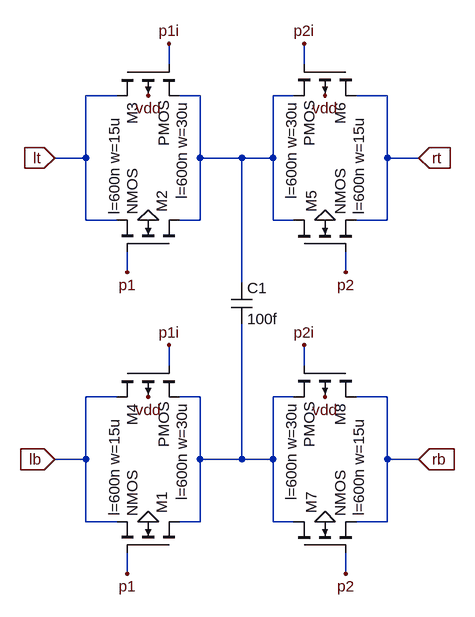
[diagram p0: schematic SC_input.asc]
SC_input.asc, the LTspice schematic file:
Version 4
SHEET 1 880 716
WIRE 320 -144 320 -176
WIRE 528 -144 528 -176
WIRE 240 -96 192 -96
WIRE 368 -96 336 -96
WIRE 512 -96 480 -96
WIRE 656 -96 608 -96
WIRE 192 0 192 -96
WIRE 192 0 144 0
WIRE 368 0 368 -96
WIRE 432 0 368 0
WIRE 480 0 480 -96
WIRE 480 0 432 0
WIRE 656 0 656 -96
WIRE 704 0 656 0
WIRE 192 96 192 0
WIRE 240 96 192 96
WIRE 368 96 368 0
WIRE 368 96 336 96
WIRE 480 96 480 0
WIRE 512 96 480 96
WIRE 656 96 656 0
WIRE 656 96 608 96
WIRE 256 176 256 144
WIRE 592 176 592 144
WIRE 432 192 432 0
WIRE 320 320 320 288
WIRE 528 320 528 288
WIRE 240 368 192 368
WIRE 368 368 336 368
WIRE 512 368 480 368
WIRE 656 368 608 368
WIRE 192 464 192 368
WIRE 192 464 144 464
WIRE 368 464 368 368
WIRE 432 464 432 256
WIRE 432 464 368 464
WIRE 480 464 480 368
WIRE 480 464 432 464
WIRE 656 464 656 368
WIRE 704 464 656 464
WIRE 192 560 192 464
WIRE 240 560 192 560
WIRE 368 560 368 464
WIRE 368 560 336 560
WIRE 480 560 480 464
WIRE 512 560 480 560
WIRE 656 560 656 464
WIRE 656 560 608 560
WIRE 256 640 256 608
WIRE 592 640 592 608
FLAG 288 96 0
FLAG 288 -96 vdd
FLAG 144 0 lt
IOPIN 144 0 In
FLAG 320 -176 p1i
FLAG 256 176 p1
FLAG 288 560 0
FLAG 288 368 vdd
FLAG 144 464 lb
IOPIN 144 464 In
FLAG 320 288 p1i
FLAG 256 640 p1
FLAG 560 96 0
FLAG 560 -96 vdd
FLAG 704 0 rt
IOPIN 704 0 In
FLAG 528 -176 p2i
FLAG 592 176 p2
FLAG 560 560 0
FLAG 560 368 vdd
FLAG 704 464 rb
IOPIN 704 464 In
FLAG 528 288 p2i
FLAG 592 640 p2
SYMBOL nmos4 336 144 M270
WINDOW 123 56 100 Left 2
WINDOW 0 60 27 Left 2
SYMATTR Value2 l=600n w=15u
SYMATTR InstName M2
SYMBOL pmos4 240 -144 M90
WINDOW 123 56 100 Left 2
WINDOW 0 59 24 Left 2
SYMATTR Value2 l=600n w=30u
SYMATTR InstName M3
SYMBOL nmos4 336 608 M270
WINDOW 123 56 100 Left 2
WINDOW 0 60 27 Left 2
SYMATTR Value2 l=600n w=15u
SYMATTR InstName M1
SYMBOL pmos4 240 320 M90
WINDOW 123 56 100 Left 2
WINDOW 0 59 24 Left 2
SYMATTR Value2 l=600n w=30u
SYMATTR InstName M4
SYMBOL nmos4 512 144 R270
WINDOW 123 56 100 Left 2
WINDOW 0 60 27 Left 2
SYMATTR Value2 l=600n w=15u
SYMATTR InstName M5
SYMBOL pmos4 608 -144 R90
WINDOW 123 56 100 Left 2
WINDOW 0 59 24 Left 2
SYMATTR Value2 l=600n w=30u
SYMATTR InstName M6
SYMBOL nmos4 512 608 R270
WINDOW 123 56 100 Left 2
WINDOW 0 60 27 Left 2
SYMATTR Value2 l=600n w=15u
SYMATTR InstName M7
SYMBOL pmos4 608 320 R90
WINDOW 123 56 100 Left 2
WINDOW 0 59 24 Left 2
SYMATTR Value2 l=600n w=30u
SYMATTR InstName M8
SYMBOL cap 416 192 R0
SYMATTR InstName C1
SYMATTR Value 100f

The netlist it stands for:
* SC_input.asc
M2 N001 p1 lt 0 NMOS l=600n w=15u
M3 lt p1i N001 vdd PMOS l=600n w=30u
M1 N002 p1 lb 0 NMOS l=600n w=15u
M4 lb p1i N002 vdd PMOS l=600n w=30u
M5 N001 p2 rt 0 NMOS l=600n w=15u
M6 rt p2i N001 vdd PMOS l=600n w=30u
M7 N002 p2 rb 0 NMOS l=600n w=15u
M8 rb p2i N002 vdd PMOS l=600n w=30u
C1 N001 N002 100f
.model NMOS NMOS
.model PMOS PMOS
.lib standard.mos
.backanno
.end